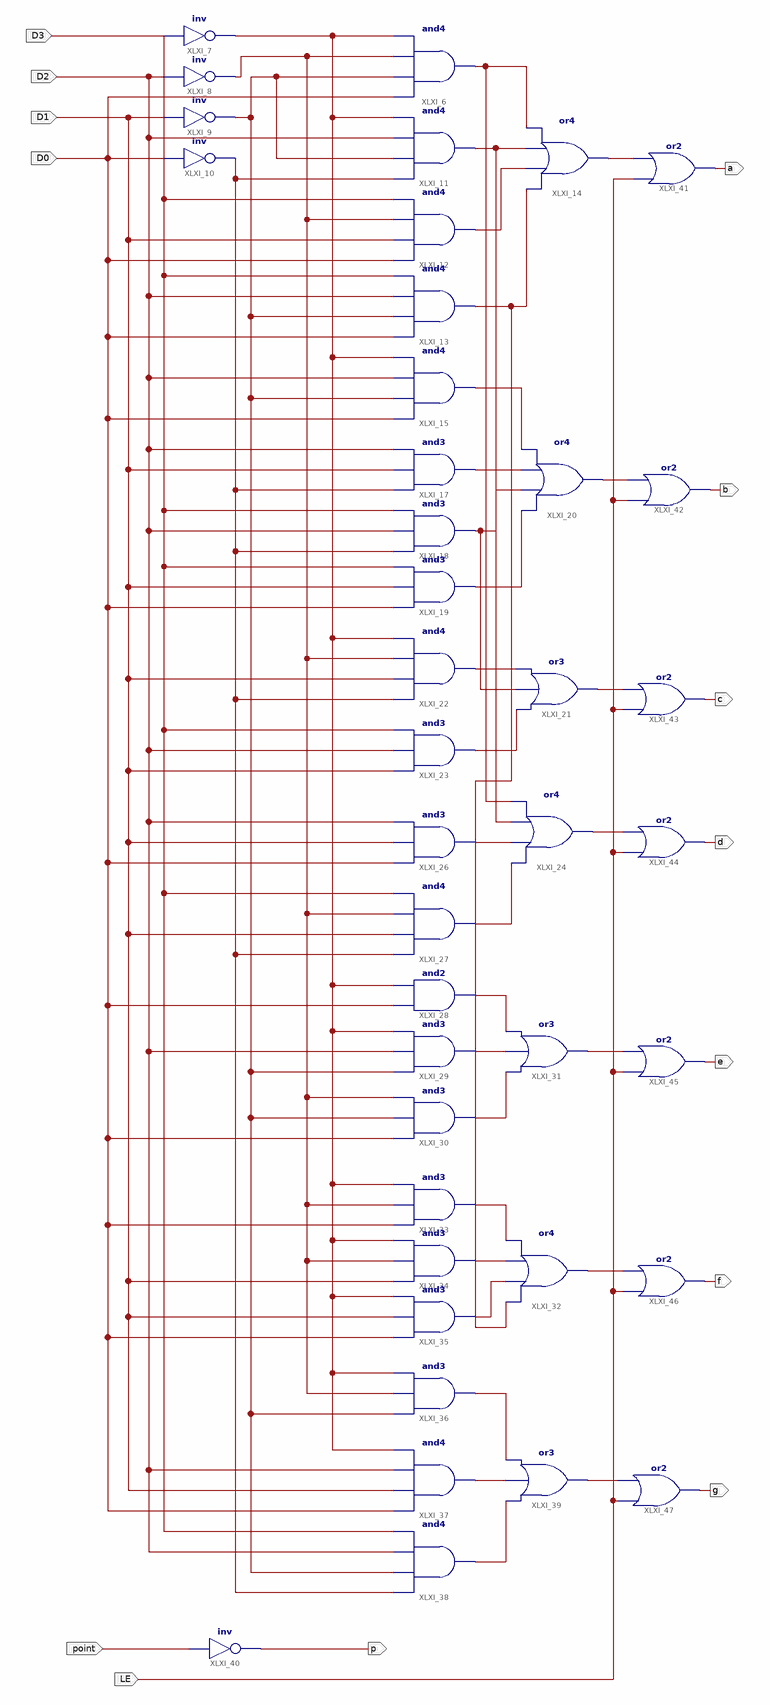
[diagram p0: schematic sheet 1]
// Xilinx ISE schematic MC14495_ZJU.sch (kintex7) as structural Verilog: 40 symbols, 14 ports
module MC14495_ZJU (
  input  D0,
  input  D2,
  input  D3,
  input  D1,
  input  point,
  input  LE,
  output p,
  output a,
  output b,
  output c,
  output d,
  output e,
  output f,
  output g
);

  wire ND0, ND1, ND2, ND3, XLXN_55, XLXN_56, XLXN_79, XLXN_80, XLXN_83, XLXN_89, XLXN_90, XLXN_94, XLXN_107,
       XLXN_111, XLXN_116, XLXN_126, XLXN_127, XLXN_128, XLXN_133, XLXN_137, XLXN_141, XLXN_142, XLXN_156,
       XLXN_157, XLXN_158, XLXN_163, XLXN_165, XLXN_167, XLXN_169, XLXN_171, XLXN_173, XLXN_175;

  not XLXI_7 (ND3, D3);
  not XLXI_8 (ND2, D2);
  not XLXI_9 (ND1, D1);
  not XLXI_10 (ND0, D0);
  and XLXI_6 (XLXN_107, D0, ND1, ND2, ND3);
  and XLXI_11 (XLXN_55, ND0, ND1, D2, ND3);
  and XLXI_12 (XLXN_56, D0, D1, ND2, D3);
  and XLXI_13 (XLXN_142, D0, ND1, D2, D3);
  or XLXI_14 (XLXN_175, XLXN_142, XLXN_56, XLXN_55, XLXN_107);
  and XLXI_15 (XLXN_79, D0, ND1, D2, ND3);
  and XLXI_17 (XLXN_80, ND0, D1, D2);
  and XLXI_18 (XLXN_90, ND0, D2, D3);
  and XLXI_19 (XLXN_83, D0, D1, D3);
  or XLXI_20 (XLXN_173, XLXN_83, XLXN_90, XLXN_80, XLXN_79);
  or XLXI_21 (XLXN_171, XLXN_94, XLXN_90, XLXN_89);
  and XLXI_22 (XLXN_89, ND0, D1, ND2, ND3);
  and XLXI_23 (XLXN_94, D1, D2, D3);
  or XLXI_24 (XLXN_169, XLXN_116, XLXN_111, XLXN_55, XLXN_107);
  and XLXI_26 (XLXN_111, D0, D1, D2);
  and XLXI_27 (XLXN_116, ND0, D1, ND2, D3);
  and XLXI_28 (XLXN_126, D0, ND3);
  and XLXI_29 (XLXN_127, ND1, D2, ND3);
  and XLXI_30 (XLXN_128, D0, ND1, ND2);
  or XLXI_31 (XLXN_167, XLXN_128, XLXN_127, XLXN_126);
  or XLXI_32 (XLXN_165, XLXN_142, XLXN_141, XLXN_137, XLXN_133);
  and XLXI_33 (XLXN_133, D0, ND2, ND3);
  and XLXI_34 (XLXN_137, D1, ND2, ND3);
  and XLXI_35 (XLXN_141, D0, D1, ND3);
  and XLXI_36 (XLXN_157, ND1, ND2, ND3);
  and XLXI_37 (XLXN_156, D0, D1, D2, ND3);
  and XLXI_38 (XLXN_158, ND0, ND1, D2, D3);
  or XLXI_39 (XLXN_163, XLXN_158, XLXN_156, XLXN_157);
  not XLXI_40 (p, point);
  or XLXI_41 (a, LE, XLXN_175);
  or XLXI_42 (b, LE, XLXN_173);
  or XLXI_43 (c, LE, XLXN_171);
  or XLXI_44 (d, LE, XLXN_169);
  or XLXI_45 (e, LE, XLXN_167);
  or XLXI_46 (f, LE, XLXN_165);
  or XLXI_47 (g, LE, XLXN_163);
endmodule
